# EAGLE design XR1 (EAGLE 7.4.0)
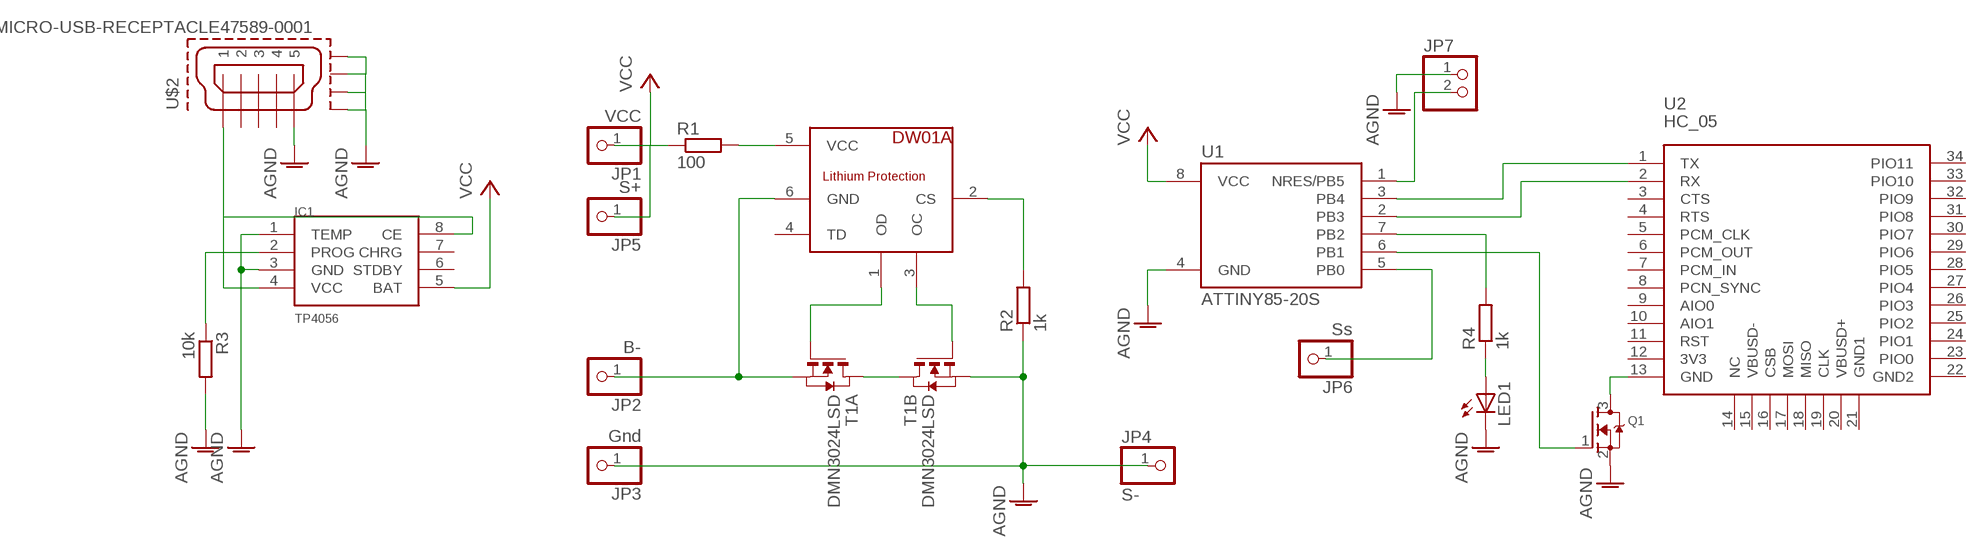
[diagram p0: schematic, sheet 1]

## Parts
IC1  TP4056  [SOP-8]
JP1  VCC  PINHD-1X1  [1X01]
JP2  B-  PINHD-1X1  [1X01]
JP3  Gnd  PINHD-1X1  [1X01]
JP4  S-  PINHD-1X1  [1X01]
JP5  S+  PINHD-1X1  [1X01]
JP6  Ss  PINHD-1X1  [1X01]
JP7  PINHD-1X2  [1X02]
LED1  LEDCHIP-LED0603  [CHIP-LED0603]
Q1  MOSFET-NREFLOW  [SOT23]
R1  100  R-EU_R0603  [R0603]
R2  1k  R-EU_R0603  [R0603]
R3  10k  R-EU_R0603  [R0603]
R4  1k  R-EU_R0603  [R0603]
T1  DMN3024LSD  [TSSOP-8]
U1  ATTINY85-20S  [SOIC8_EIAJ_208MIL]
U2  HC_05  [BLUETOOTH_SMD]
U$1  DW01A  [SOT23-6]
U$2  MICRO-USB-RECEPTACLE47589-0001  [47589-0001]

## Nets
AGND: IC1.1(TEMP) IC1.3(GND) JP3.1 JP4.1 JP7.1 LED1.C Q1.2(S) R2.1 R3.2 T1.6(B:S) T1.7(B:S) U1.4(GND) U$2.5 U$2.CASING1(GND1) U$2.CASING2(GND2) U$2.CASING3(GND3) U$2.CASING4(GND4)
N$1: T1.4(A:G) U$1.1(OD)
N$2: T1.5(B:G) U$1.3(OC)
N$3: T1.1(A:D) T1.8(B:D)
N$4: R2.2 U$1.2(CS)
N$5: JP2.1 T1.2(A:S) T1.3(A:S) U$1.6(GND)
N$6: R1.2 U$1.5(VCC)
N$7: IC1.2(PROG) R3.1
N$8: JP6.1 U1.5(PB0)
N$9: IC1.4(VCC) IC1.8(CE) U$2.1
N$10: JP7.2 U1.1(NRES/PB5)
N$11: Q1.3(D) U2.13(GND)
N$12: Q1.1(G) U1.6(PB1)
N$13: U1.3(PB4) U2.1(TX)
N$14: U1.2(PB3) U2.2(RX)
N$15: R4.2 U1.7(PB2)
N$16: LED1.A R4.1
VCC: IC1.5(BAT) JP1.1 JP5.1 R1.1 U1.8(VCC)
Unconnected: IC1.6(STDBY) IC1.7(CHRG) U2.3(CTS) U2.4(RTS) U2.5(PCM_CLK) U2.6(PCM_OUT) U2.7(PCM_IN) U2.8(PCN_SYNC) U2.9(AIO0) U2.10(AIO1) U2.11(RST) U2.12(3V3) U2.14(NC) U2.15(VBUSD-) U2.16(CSB) U2.17(MOSI) U2.18(MISO) U2.19(CLK) U2.20(VBUSD+) U2.21(GND1) U2.22(GND2) U2.23(PIO0) U2.24(PIO1) U2.25(PIO2) U2.26(PIO3) U2.27(PIO4) U2.28(PIO5) U2.29(PIO6) U2.30(PIO7) U2.31(PIO8) U2.32(PIO9) U2.33(PIO10) U2.34(PIO11) U$1.4(TD) U$2.2 U$2.3 U$2.4

## Library data of the parts
IC1 = TP4056:TP4056
JP1-JP6 = pinhead:PINHD-1X1: PIN HEADER
JP7 = pinhead:PINHD-1X2: PIN HEADER
LED1 = adafruit:LED: LED OSRAM: - CHIPLED LG R971, LG N971, LY N971, LG Q971, LY Q971, LO R971, LY R971 LH N974, LH R974 LS Q976, LO Q976, LY Q976 LO Q996 - Hyper CHIPLED LW Q18S LB Q993, LB Q99A, LB R99A - SideLED LS A670, LO A670, LY A670, LG A670, LP A670 LB A673, LV A673, LT A673, LW A673 LH A674 LY A675 LS A676, LA A676, LO A676, LY A676, LW A676 LS A679, LY A679, LG A679 - Hyper Micro SIDELED® LS Y876, LA Y876, LO Y876, LY Y876 LT Y87S - SmartLED LW L88C, LW L88S LB L89C, LB L89S, LG L890 LS L89K, LO L89K, LY L89K LS L896, LA L896, LO L896, LY L896 - TOPLED LS T670, LO T670, LY T670, LG T670, LP T670 LSG T670, LSP T670, LSY T670, LOP T670, LYG T670 LG T671, LOG T671, LSG T671 LB T673, LV T673, LT T673, LW T673 LH T674 LS T676, LA T676, LO T676, LY T676, LB T676, LH T676, LSB T676, LW T676 LB T67C, LV T67C, LT T67C, LS T67K, LO T67K, LY T67K, LW E67C LS E67B, LA E67B, LO E67B, LY E67B, LB E67C, LV E67C, LT E67C LW T67C LS T679, LY T679, LG T679 LS T770, LO T770, LY T770, LG T770, LP T770 LB T773, LV T773, LT T773, LW T773 LH T774 LS E675, LA E675, LY E675, LS T675 LS T776, LA T776, LO T776, LY T776, LB T776 LHGB T686 LT T68C, LB T68C - Hyper Mini TOPLED® LB M676 - Mini TOPLED Santana® LG M470 LS M47K, LO M47K, LY M47K Source: http://www.osram.convergy.de/
Q1 = adafruit:MOSFET-N: N-Channel Mosfet 2N7002E - 60V 260mA SOT23 [Digikey: 2N7002ET1GOSTR-ND] - REEL BSH103 - 30V 850mA SOT23 [Digikey: 568-5013-1-ND]
R1-R4 = rcl:R-EU_: RESISTOR, European symbol
T1 = FS8205A:DMN3024LSD: DUAL N-CHANNEL ENHANCEMENT MODE MOSFET data sheet <http://goo.gl/dRgboR> Dave.Calaway Eagle Library <https://goo.gl/Muy1Tr>
U1 = _hhn_attiny25_45_85:ATTINY85*: ATMEL ATtiny 85 Packages: P = PDIP 08 30mil S = SOIC 08 EIAJ 208mil Technologies Note: for complete ordering code (temp. range, finish, tape&reel etc.) see www.atmel.com • Supply Voltage: V = (1.8…5.5)V | [blank] = (2.7…5.5)V • Speed: 10 = 10 MHz | 20 = 20 MHz Author: Dipl.-Ing. FH Rainer Bayer HHN Hochschule Heilbronn (Heilbronn University), rainer.bayer@hs-heilbronn.de Ingenieurbüro ing-rb, mail@ing-rb.de
U2 = HC-06:HC_05
U$1 = DW01a:DW01A
U$2 = con-molex-usb:MICRO-USB-RECEPTACLE: MICRO USB RECEPTACLES Micro-USB Receptacles, SMT, Lead-Free from MOLEX <http://www.molex.com/>. (C) 2014 Tomasz Boleslaw CEDRO, cederom@tlen.pl, http://www.tomek.cedro.info. Version 0.1 (2014-01-17): Initial release. Version 0.2 (2014-02-06): Updated 47589-0001 footprint pins/pads/milling. Following devices are included: 1. 47589-0001 Micro-USB AB Receptacle, Bottom Mount, SMT, Lead-Free <http://www.molex.com/molex/products/datasheet.jsp?part=active/0475890001_IO_CONNECTORS.xml> (Technical Drawing <http://www.molex.com/pdm_docs/sd/475890001_sd.pdf>).

## Board
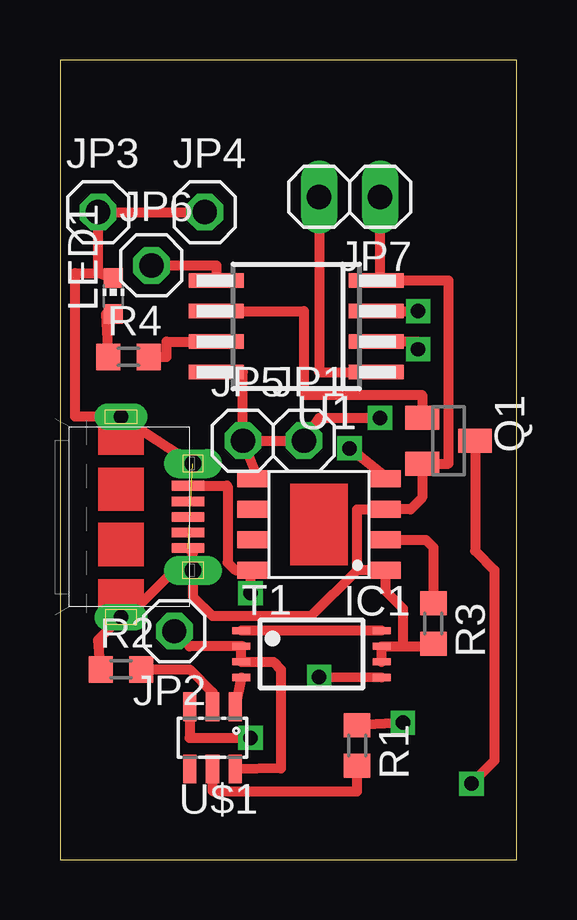
[diagram p1: board, top side]
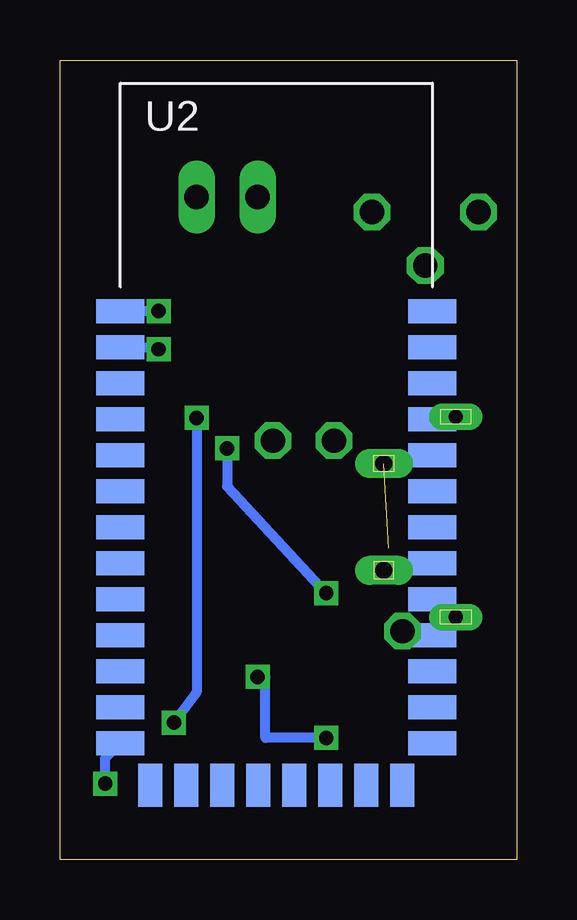
[diagram p2: board, bottom side, seen from below]

Size 19.03 x 33.33 mm. Coordinates in mm from the lower left corner, seen from the top.
Outline: 0,0 19.03,0 19.03,33.33 0,33.33 0,0
Copper layers (1*16): Top 0.035mm / dielectric 1.5mm / Bottom 0.035mm
Design rules "default": minimum track width 10mil, minimum drill 24mil, track to track 8mil, track to pad 8mil, pad to pad 8mil, via to via 8mil, smd to smd 8mil, copper to edge 40mil, drill to drill 8mil, minimum pad ring 10mil, minimum via ring 8mil, stop-mask expansion 4mil, vias tented up to drill 0mil, thermal gap 10mil

### Footprints (pad centres in the part's own frame; a part is rotated, then mirrored left to right if it is on the bottom)
SOP-8 = smd 1.3 x 0.7: 1 -2.75,1.905; 2 -2.75,0.635; 3 -2.75,-0.635; 4 -2.75,-1.905; 5 2.75,-1.905; 6 2.75,-0.635; 7 2.75,0.635; 8 2.75,1.905
1X01 = drill 1.016 octagon: 1 0,0
1X02 = drill 1.016 long: 1 -1.27,0; 2 1.27,0
CHIP-LED0603 = smd 0.8 x 0.8: A 0,-0.75; C 0,0.75
SOT23 = smd 1 x 1.4: 1 -0.95,-1.1; 2 0.95,-1.1; 3 0,1.1
R0603 = smd 1 x 1.1: 1 -0.85,0; 2 0.85,0
TSSOP-8 = smd 0.3 x 0.75: 1 -0.975,-2.925; 2 -0.325,-2.925; 3 0.325,-2.925; 4 0.975,-2.925; 5 0.975,2.925; 6 0.325,2.925; 7 -0.325,2.925; 8 -0.975,2.925
SOIC8_EIAJ_208MIL = smd 0.6 x 2.286: 1 -1.905,-3.33; 2 -0.635,-3.33; 3 0.635,-3.33; 4 1.905,-3.33; 5 1.905,3.33; 6 0.635,3.33; 7 -0.635,3.33; 8 -1.905,3.33
BLUETOOTH_SMD = smd 2 x 1: 1 0,0; 2 0,-1.5; 3 0,-3; 4 0,-4.5; 5 0,-6; 6 0,-7.5; 7 0,-9; 8 0,-10.5; 9 0,-12; 10 0,-13.5; 11 0,-15; 12 0,-16.5; 13 0,-18; 22 13,-18; 23 13,-16.5; 24 13,-15; 25 13,-13.5; 26 13,-12; 27 13,-10.5; 28 13,-9; 29 13,-7.5; 30 13,-6; 31 13,-4.5; 32 13,-3; 33 13,-1.5; 34 13,0 | smd 1 x 1.8: 14 1.25,-19.75; 15 2.75,-19.75; 16 4.25,-19.75; 17 5.75,-19.75; 18 7.25,-19.75; 19 8.75,-19.75; 20 10.25,-19.75; 21 11.75,-19.75
SOT23-6 = smd 0.55 x 1.2: 1 -0.95,-1.3; 2 0,-1.3; 3 0.95,-1.3; 4 0.95,1.3; 5 0,1.3; 6 -0.95,1.3
47589-0001 = smd 1.35 x 0.4: 1 2.8,1.3; 2 2.8,0.65; 3 2.8,0; 4 2.8,-0.65; 5 2.8,-1.3 | drill 0.6 pad 0.95 long: CASING1 0,4.175; CASING2 0,-4.175 | drill 0.7 pad 1.1 long: CASING3 3,2.225; CASING4 3,-2.225

### Placement (x,y rotation side)
IC1  10.79,13.97 180 top
JP1  10.16,17.46 0 top
JP2  4.76,9.53 180 top
JP3  1.59,26.99 0 top
JP4  6.03,26.99 0 top
JP5  7.62,17.46 0 top
JP6  3.81,24.77 0 top
JP7  12.06,27.62 180 top
LED1  2.22,23.5 0 top
Q1  16.19,17.46 270 top
R1  12.38,4.76 270 top
R2  2.54,7.94 0 top
R3  15.56,9.84 270 top
R4  2.86,20.95 0 top
T1  10.48,8.57 270 top
U1  9.84,22.23 90 top
U2  16.51,22.86 0 bottom
U$1  6.35,5.08 180 top
U$2  2.54,14.29 0 top

### Tracks (layer width: path | path; a pad name or v marks a point on that pad's centre or on a via)
AGND  (1 unrouted)
  Top 0.406: JP7.1 13.34,24.13 U1.4 16.19,24.13 16.19,16.51 Q1.2 15.09,15.09 14.61,14.61 IC1.3 12.38,14.61 12.38,12.06 | JP4.1 JP3.1 1.59,24.45 | LED1.C 1.59,24.45 | 1.59,24.45 0.64,24.45 0.64,18.46 U$2.CASING1 U$2.CASING3 | T1.6 T1.7 14.29,8.9 | 12.38,12.06 IC1.1 13.54,11.22 14.29,10.48 14.29,8.9 | 14.29,8.9 15.55,8.9 R3.2 | U$2.CASING4 5.54,12.79 U$2.5 | U$2.CASING4 5.54,10.97 6.35,10.16 10.48,10.16 12.38,12.06 | R2.1 1.59,9.16 U$2.CASING2 2.81,10.11 4.76,12.06 U$2.CASING4
N$1
  Top 0.406: T1.4 U$1.1
N$2  (via drill 0.6)
  Top 0.406: U$1.3 5.4,5.08 v7.94,5.08 | v10.79,7.62 T1.5
  Bottom 0.406: v7.94,5.08 10.48,5.08 10.48,7.62 v10.79,7.62
N$3
  Top 0.406: T1.8 T1.1
N$4
  Top 0.406: R2.2 5.4,7.94 6.35,6.99 U$1.2
N$5
  Top 0.406: T1.3 T1.2 | T1.3 7.55,8.82 7.62,8.89 5.4,8.89 JP2.1 | T1.3 8.9,8.25 9.21,7.94 9.21,3.81 U$1.6
N$6
  Top 0.406: U$1.5 6.35,2.86 12.38,2.85 R1.2
N$7
  Top 0.406: IC1.2 15.24,13.34 15.56,13.02 R3.1
N$8
  Top 0.406: JP6.1 6.51,24.77 U1.5
N$9  (via drill 0.6)
  Top 0.406: IC1.4 13.65,15.88 v12.06,17.14 | v7.94,11.11 7.94,11.96 IC1.8 7.3,12.06 6.99,12.38 6.99,15.56 6.96,15.59 U$2.1
  Bottom 0.406: v12.06,17.14 12.06,15.56 v7.94,11.11
N$10
  Top 0.406: JP7.2 10.79,20.32 U1.1
N$11  (via drill 0.6)
  Top 0.406: Q1.3 17.29,12.87 18.1,12.06 18.1,4.13 v17.14,3.17
  Bottom 0.406: v17.14,3.17 17.14,4.22 U2.13
N$12
  Top 0.406: U1.6 10.16,22.86 10.16,19.37 15.09,19.37 Q1.1
N$13  (via drill 0.6)
  Top 0.406: U1.3 v14.92,22.86
  Bottom 0.406: v14.92,22.86 U2.1
N$14  (via drill 0.6)
  Top 0.406: v14.92,21.27 14.92,21.59 U1.2
  Bottom 0.406: U2.2 14.92,21.36 v14.92,21.27
N$15
  Top 0.406: R4.2 4.45,20.95 4.45,21.59 U1.7
N$16
  Top 0.406: LED1.A 1.91,22.75 R4.1
VCC  (via drill 0.6)
  Top 0.406: JP5.1 JP1.1 10.79,18.41 v13.34,18.41 | JP5.1 7.62,20.32 U1.8 | IC1.5 8.26,15.88 JP5.1 | v14.29,5.71 R1.1
  Bottom 0.406: v13.34,18.41 13.34,6.99 v14.29,5.71